# EAGLE schematic Main (EAGLE 9.5.2)
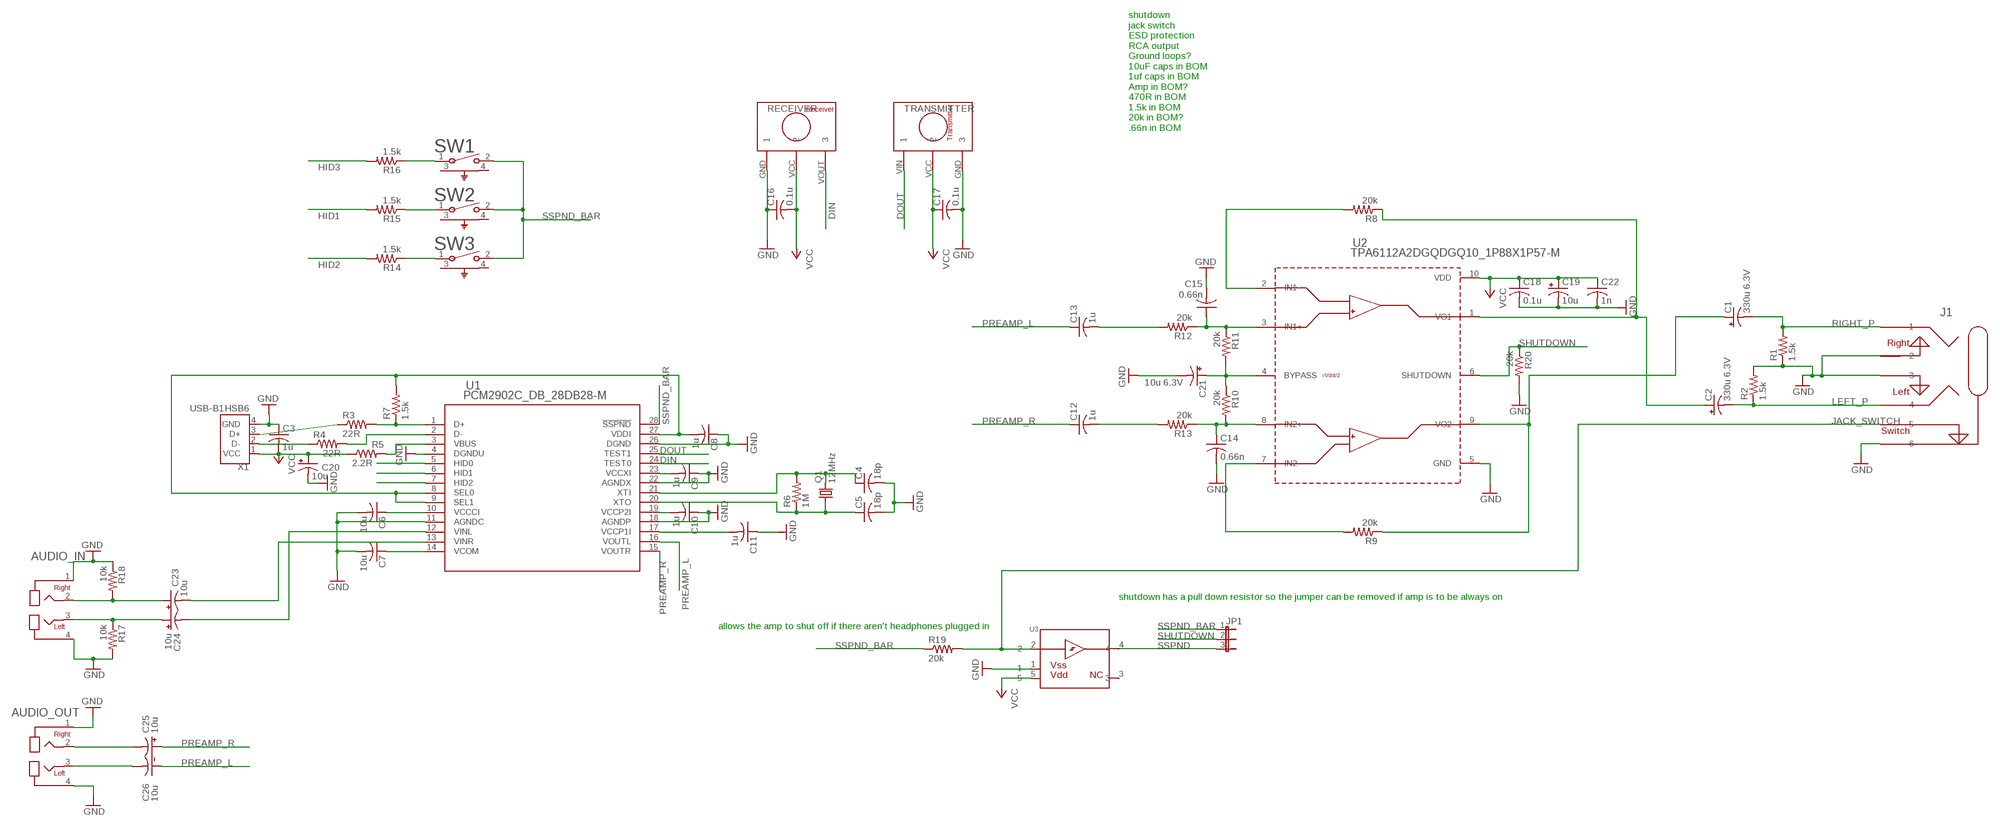
[diagram p0: schematic, sheet 1]

## Parts
AUDIO_IN  RCA-LR  [CONN_J-2121]
AUDIO_OUT  RCA-LR  [CONN_J-2121]
C1  330u 6.3V  CPOL-USE2.5-7  [E2,5-7]
C2  330u 6.3V  CPOL-USE2.5-7  [E2,5-7]
C3  1u  C-USC0805K  [C0805K]
C4  18p  C-USC0805  [C0805]
C5  18p  C-USC0805  [C0805]
C6  10u  C-USC0805  [C0805]
C7  10u  C-USC0805  [C0805]
C8  1u  C-USC0805  [C0805]
C9  1u  C-USC0805  [C0805]
C10  1u  C-USC0805  [C0805]
C11  1u  C-USC0805  [C0805]
C12  1u  C-USC0805  [C0805]
C13  1u  C-USC0805  [C0805]
C14  0.66n  C-USC0805  [C0805]
C15  0.66n  C-USC0805  [C0805]
C16  0.1u  C-USC0805K  [C0805K]
C17  0.1u  C-USC0805K  [C0805K]
C18  0.1u  C-USC0805K  [C0805K]
C19  10u  CPOL-USE2.5-5  [E2,5-5]
C20  10u  CPOL-USE2.5-5  [E2,5-5]
C21  10u 6.3V  CPOL-USE2.5-5  [E2,5-5]
C22  1n  C-USC0805  [C0805]
C23  10u  CPOL-USE2.5-5  [E2,5-5]
C24  10u  CPOL-USE2.5-5  [E2,5-5]
C25  10u  CPOL-USE2.5-5  [E2,5-5]
C26  10u  CPOL-USE2.5-5  [E2,5-5]
J1  ACJS-MHDR  [CONN_MHDR_AMP]
JP1  JP2W  [JP2W]
Q1  12MHz  CRYSTALHC49S  [HC49/S]
R1  1.5k  R-US_R0805  [R0805]
R2  1.5k  R-US_R0805  [R0805]
R3  22R  R-US_M0805  [M0805]
R4  22R  R-US_M0805  [M0805]
R5  2.2R  R-US_M0805  [M0805]
R6  1M  R-US_M0805  [M0805]
R7  1.5k  R-US_M0805  [M0805]
R8  20k  R-US_R0805  [R0805]
R9  20k  R-US_R0805  [R0805]
R10  20k  R-US_R0805  [R0805]
R11  20k  R-US_R0805  [R0805]
R12  20k  R-US_R0805  [R0805]
R13  20k  R-US_R0805  [R0805]
R14  1.5k  R-US_M0805  [M0805]
R15  1.5k  R-US_M0805  [M0805]
R16  1.5k  R-US_M0805  [M0805]
R17  10k  R-US_R0805  [R0805]
R18  10k  R-US_R0805  [R0805]
R19  20k  R-US_R0805  [R0805]
R20  20k  R-US_R0805  [R0805]
RECEIVER  EAPLRAA4  [EAPLRAA4]
SW1  1825027-8  [SW2_1825027-C]
SW2  1825027-8  [SW2_1825027-C]
SW3  1825027-8  [SW2_1825027-C]
TRANSMITTER  EAPLTAA4  [EAPLTAA4]
U1  PCM2902C_DB_28DB28-M  [DB28-M]
U2  TPA6112A2DGQDGQ10_1P88X1P57-M  [DGQ10_1P88X1P57-M]
U3  TC4S584F  [SOT-25___(SMV)]
X1  USB-B1HSB6  [OST_USB-B1HSB6]

## Nets
DIN: RECEIVER.VOUT U1.24(TEST0)
DOUT: TRANSMITTER.VIN U1.25(TEST1)
GND: AUDIO_IN.1 AUDIO_IN.4 AUDIO_OUT.1 AUDIO_OUT.4 C3.1 C4.2 C5.2 C6.2 C7.2 C8.1 C9.1 C10.1 C11.1 C14.2 C15.2 C16.1 C17.2 C18.2 C19.- C20.- C21.- C22.2 J1.1 J1.2 J1.3 R1.1 R2.2 R17.2 R18.1 R20.2 RECEIVER.GND TRANSMITTER.GND U1.4(DGNDU) U1.11(AGNDC) U1.18(AGNDP) U1.22(AGNDX) U1.26(DGND) U2.5(GND) U3.1 X1.4(GND)
HID0: U1.5(HID0)
HID1: R15.2 U1.6(HID1)
HID2: R14.2 U1.7(HID2)
HID3: R16.2
JACK_SWITCH: J1.6 R19.2 U3.2
LEFT_P: C2.- J1.4 R2.1
N$1: R3.1 X1.3(D+)
N$2: C8.2 R3.2 R7.1 R7.2 U1.1(D+) U1.8(SEL0) U1.9(SEL1) U1.27(VDDI)
N$3: R4.2 U1.2(D-)
N$4: C2.+ R8.1 U2.1(VO1)
N$5: AUDIO_IN.2 C23.+ R18.2
N$6: C1.+ R9.1 U2.9(VO2)
N$7: C23.- U1.13(VINR)
N$8: R4.1 X1.2(D-)
N$9: R8.2 U2.2(IN1-)
N$10: C9.2 U1.23(VCCXI)
N$11: R5.2 U1.3(VBUS)
N$12: C4.1 Q1.2 R6.2 U1.21(XTI)
N$13: C5.1 Q1.1 R6.1 U1.20(XTO)
N$14: C10.2 U1.19(VCCP2I)
N$15: C7.1 U1.14(VCOM)
N$16: C6.1 U1.10(VCCCI)
N$17: C11.2 U1.17(VCCP1I)
N$18: R9.2 U2.7(IN2-)
N$19: C14.1 R10.2 R13.1 U2.8(IN2+)
N$20: C21.+ R10.1 R11.2 U2.4(BYPASS)
N$21: C15.1 R11.1 R12.1 U2.3(IN1+)
N$22: R14.1 SW3.1
N$23: C12.2 R13.2
N$24: C13.2 R12.2
N$25: R15.1 SW2.1
N$26: R16.1 SW1.1
N$27: C24.- U1.12(VINL)
N$28: AUDIO_IN.3 C24.+ R17.1
N$29: AUDIO_OUT.2 C25.-
N$30: AUDIO_OUT.3 C26.-
PREAMP_L: C13.1 C26.+ U1.16(VOUTL)
PREAMP_R: C12.1 C25.+ U1.15(VOUTR)
RIGHT_P: C1.- J1.5 R1.2
SHUTDOWN: JP1.2 R20.1 U2.6(SHUTDOWN)
SSPND: JP1.3 U3.4
SSPND_BAR: JP1.1 R19.1 SW1.2 SW2.2 SW3.2 U1.28(!SSPND)
VCC: C3.2 C16.2 C17.1 C18.1 C19.+ C20.+ C22.1 R5.1 RECEIVER.VCC TRANSMITTER.VCC U2.10(VDD) U3.5 X1.1(VCC)
Unconnected: SW1.3 SW1.4 SW2.3 SW2.4 SW3.3 SW3.4 U3.3

## Notes on the sheet
- shutdown
  jack switch
  ESD protection
  RCA output
  Ground loops?
  10uF caps in BOM
  1uf caps in BOM
  Amp in BOM?
  470R in BOM
  1.5k in BOM
  20k in BOM?
  .66n in BOM
- shutdown has a pull down resistor so the jumper can be removed if amp is to be always on
- allows the amp to shut off if there aren't headphones plugged in

## Library data of the parts
AUDIO_IN AUDIO_OUT = Jacks_library:RCA-LR
C1 C2 C19-C21 C23-C26 = rcl:CPOL-US: POLARIZED CAPACITOR, American symbol; SPICEPREFIX: C
C3-C11 C14-C18 C22 = rcl-2:C-US: CAPACITOR, American symbol
C12 C13 = rcl:C-US: CAPACITOR, American symbol; SPICEPREFIX: C
J1 = Jacks_library:ACJS-MHDR; BUILT_BY: EMA_Matt; COPYRIGHT: Copyright (C) 2018 Accelerated Designs. All rights reserved; MANUFACTURER_PART_NUMBER: ACJS-MHDR; SOURCELIBRARY: Amphenol_2019-10-30; VENDOR: Amphenol
JP1 = jumper:JP2W: JUMPER
Q1 = crystal:CRYSTAL: CRYSTAL; OC_FARNELL: 1667008; OC_NEWARK: unknown
R1 R2 R8-R13 R17-R20 = rcl:R-US_: RESISTOR, American symbol; SPICEPREFIX: R
R3-R7 R14-R16 = rcl-2:R-US_: RESISTOR, American symbol
RECEIVER = Jacks_library:EAPLRAA4
SW1-SW3 = Jacks_library:1825027-8; BUILT_BY: EMA_UL_Team; CONFIGURATION__POLE-THROW_: Single Pole - Single Throw; COPYRIGHT: Copyright (C) 2016 Accelerated Designs. All rights reserved; DESCRIPTION: FSMRA3JH04=R/A,TACT PB SW,160G; MANUFACTURER_PART_NUMBER: 1825027-8; MAX_SWITCHING_CURRENT: -; MAX_SWITCHING_VOLTAGE_AC_: -; PRODUCT_TYPE: Switch; SOURCELIBRARY: TE_Connectivity-2018-03-16; SWITCH_TYPE: Tactile Switches; TE_PART_NUMBER: 1825027-8; VENDOR: TE Connectivity
TRANSMITTER = Jacks_library:EAPLTAA4
U1 = Jacks_library:PCM2902C_DB_28; DATASHEET_URL: http://www.ti.com/lit/gpn/PCM2902C; DESCRIPTION: Stereo Audio Codec with USB Interface, Single-Ended Analog and S/PDIF In/Out; FAMILY_NAME: USB CODECS; GENERIC_PART_NUMBER: PCM2902C; INDUSTRY_STD_PKG_TYPE: SSOP; MANUFACTURER: Texas Instruments; MANUFACTURER_PART_NUMBER: PCM2902C_DB_28; PACKAGE_DESIGNATOR: DB; PIN_COUNT: 28; VENDOR: Texas Instruments
U2 = Jacks_library:TPA6112A2DGQ; DATASHEET_URL: http://www.ti.com/lit/gpn/TPA6112A2; DESCRIPTION: 150-mW Stereo Headphone Audio Amplifier with Differential Input; FAMILY_NAME: HEADPHONE AMPLIFIER; GENERIC_PART_NUMBER: TPA6112A2; INDUSTRY_STD_PKG_TYPE: MSOP-PowerPAD; MANUFACTURER: Texas Instruments; MANUFACTURER_PART_NUMBER: TPA6112A2DGQ; PACKAGE_DESIGNATOR: DGQ; PIN_COUNT: 10; VENDOR: Texas Instruments
U3 = Jacks_library:TC4S584F; COPYRIGHT: Copyright (C) 2018 Accelerated Designs. All rights reserved; MANUFACTURER_PART_NUMBER: TC4S584F; SOURCELIBRARY: Toshiba_2019-02-06; VENDOR: Toshiba
X1 = Jacks_library:USB-B1HSB6: Conn Usb Type b r/a Black; AVAILABILITY: Unavailable; DESCRIPTION: USB-B _USB TYPE-B_ Receptacle Connector 4 Position Through Hole, Right Angle; MF: On Shore; MP: USB-B1HSB6; PACKAGE: None; PRICE: None